# EAGLE design Randys_Gut (EAGLE 9.6.2)
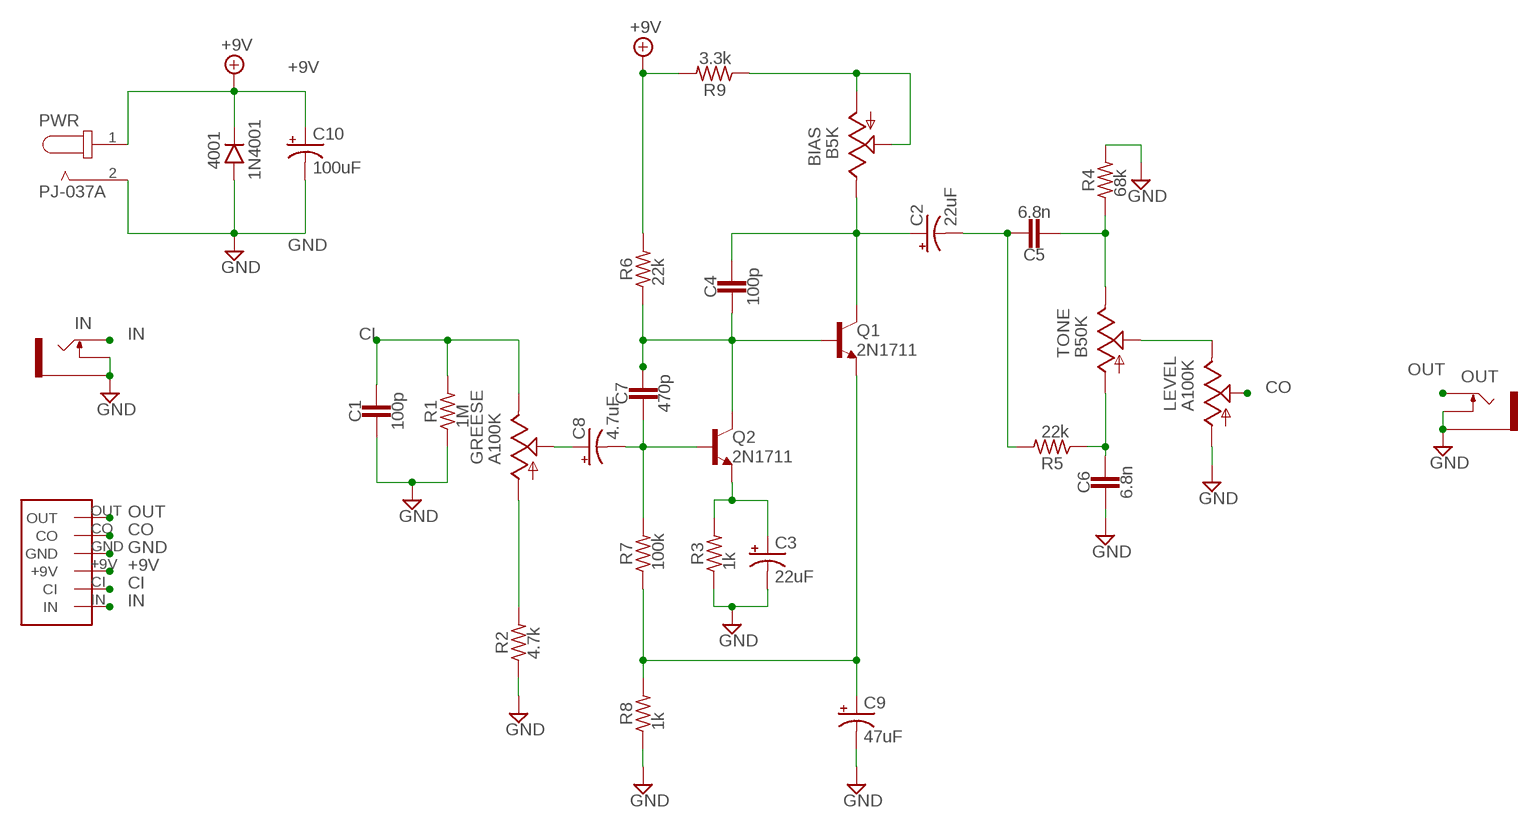
[diagram p0: schematic, sheet 1]

## Parts
4001  1N4001  DO41.3  [DO41-3]
BIAS  B5K  9MM_SNAP-IN_POT_  [9MM_SNAP-IN_POT]
C1  100p  CAP.2  [0.2".SML]
C2  22uF  0501  [050_020_1]
C3  22uF  0501  [050_020_1]
C4  100p  CAP.2  [0.2".SML]
C5  6.8n  CAP.2  [0.2".SML]
C6  6.8n  CAP.2  [0.2".SML]
C7  470p  CAP.2  [0.2".SML]
C8  4.7uF  0501  [050_020_1]
C9  47uF  0631  [063_025]
C10  100uF  0631  [063_025]
GREESE  A100K  9MM_SNAP-IN_POT_  [9MM_SNAP-IN_POT]
IN  THONKICONNNEW  [WQP-PJ301M-12_JACK]
LEVEL  A100K  9MM_SNAP-IN_POT_  [9MM_SNAP-IN_POT]
OUT  THONKICONNNEW  [WQP-PJ301M-12_JACK]
PWR  PJ-037A  [CUI_PJ-037A]
Q1  2N1711  2N2222A  [TO18]
Q2  2N1711  2N2222A  [TO18]
R1  1M  RESISTORS.3B  [R0207/3]
R2  4.7k  RESISTORS.3B  [R0207/3]
R3  1k  RESISTORS.3B  [R0207/3]
R4  68k  RESISTORS.3B  [R0207/3]
R5  22k  RESISTORS.3B  [R0207/3]
R6  22k  RESISTORS.3B  [R0207/3]
R7  100k  RESISTORS.3B  [R0207/3]
R8  1k  RESISTORS.3B  [R0207/3]
R9  3.3k  RESISTORS.3B  [R0207/3]
TONE  B50K  9MM_SNAP-IN_POT_  [9MM_SNAP-IN_POT]
U$2  HEADERS6  [HEADERS6]

## Nets
+9V: 4001.C C10.+ PWR.1 R6.2 R9.2 U$2.+9V
C3: C7.2 C8.- Q2.2(B) R7.2
CI: C1.1 GREESE.3(E) R1.2 U$2.CI
CO: LEVEL.2(S) U$2.CO
GND: 4001.A C1.2 C3.- C6.2 C9.- C10.- IN.P$2_SWITCH(SWITCH) IN.P$3_SLEEVE(SLEEVE) LEVEL.1(A) OUT.P$2_SWITCH(SWITCH) OUT.P$3_SLEEVE(SLEEVE) PWR.2 R1.1 R2.1 R3.1 R4.2 R8.1 U$2.GND
IN: IN.P$1_TIP(TIP) U$2.IN
N$1: GREESE.1(A) R2.2
N$3: C8.+ GREESE.2(S)
N$5: C9.+ Q1.1(E) R7.1 R8.2
N$6: C4.2 C7.1 Q1.2(B) Q2.3(C) R6.1
N$7: C3.+ Q2.1(E) R3.2
N$8: BIAS.3(E) C2.+ C4.1 Q1.3(C)
N$9: C2.- C5.1 R5.2
N$10: BIAS.1(A) BIAS.2(S) R9.1
N$11: C5.2 R4.1 TONE.3(E)
N$12: C6.1 R5.1 TONE.1(A)
N$13: LEVEL.3(E) TONE.2(S)
OUT: OUT.P$1_TIP(TIP) U$2.OUT

## Library data of the parts
4001 = diodes:DO41: DO-41 Package Diodes: 1N4001 - 1N40019 Zener Diodes: 1N4728 - 1N4764
BIAS GREESE LEVEL TONE = MusicThingModular:9MM_SNAP-IN_POT: 9mm vertical snap-in pot, Alpha / Panasonic style
C1 C4-C7 = caps-film:CAP: For Ceramic, Film, MLCC caps
C2 C3 C8 = caps-elec:050: 0.22 - 100uF Xicon values at Mouser.com: 10V: 10 - 100uF; 16V: 2.2 - 47uF; 25V: 0.47 - 47uF; 50V: 0.22 - 22uF
C9 C10 = caps-elec:063: 33 - 220uF Xicon values at Mouser.com 10V: 220uF; 16V: 100uF; 25V: 100uF; 50V: 33uF
IN OUT = MusicThingModular:THONKICONN: 3.5mm socket for Eurorack modular synths
PWR = Power Socket PJ-037A:PJ-037A: 2.0 mm Center Pin, 2.5 A, Right Angle, Through Hole, Dc Power Jack Connector; AVAILABILITY: Unavailable; CUI_PURCHASE_URL: https://www.cuidevices.com/product/interconnect/connectors/dc-power-connectors/jacks/pj-037a?utm_source=snapeda.com&utm_medium=referral&utm_campaign=snapedaBOM; DESCRIPTION: 2.0 x 6.5 mm, 2.5 A, Horizontal, Through Hole, Dc Power Jack Connector; MF: CUI Devices; MP: PJ-037A; PACKAGE: None; PRICE: None
Q1 Q2 = transistors-BJT:2N2222A: NPN [E]-B-C. TO-18 metal can transistor. 2n2369: http://smallbear-electronics.mybigcommerce.com/transistor-2n2369/
R1-R9 = resistors:RESISTORS
U$2 = my_headers:HEADERS6

## Board
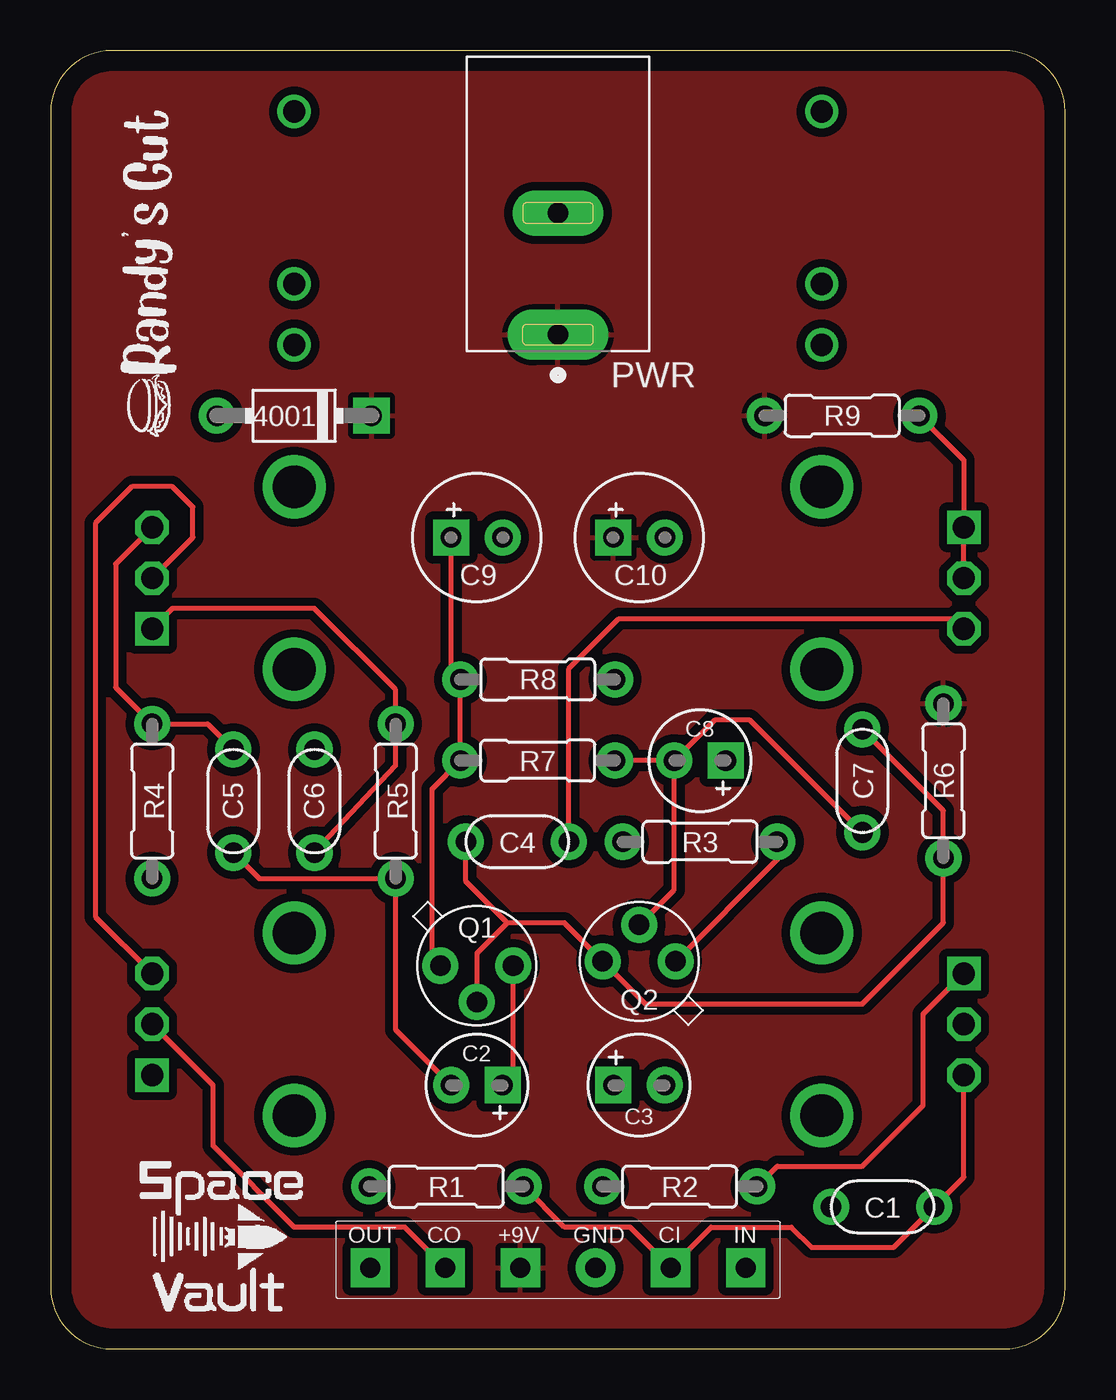
[diagram p1: board, top side]
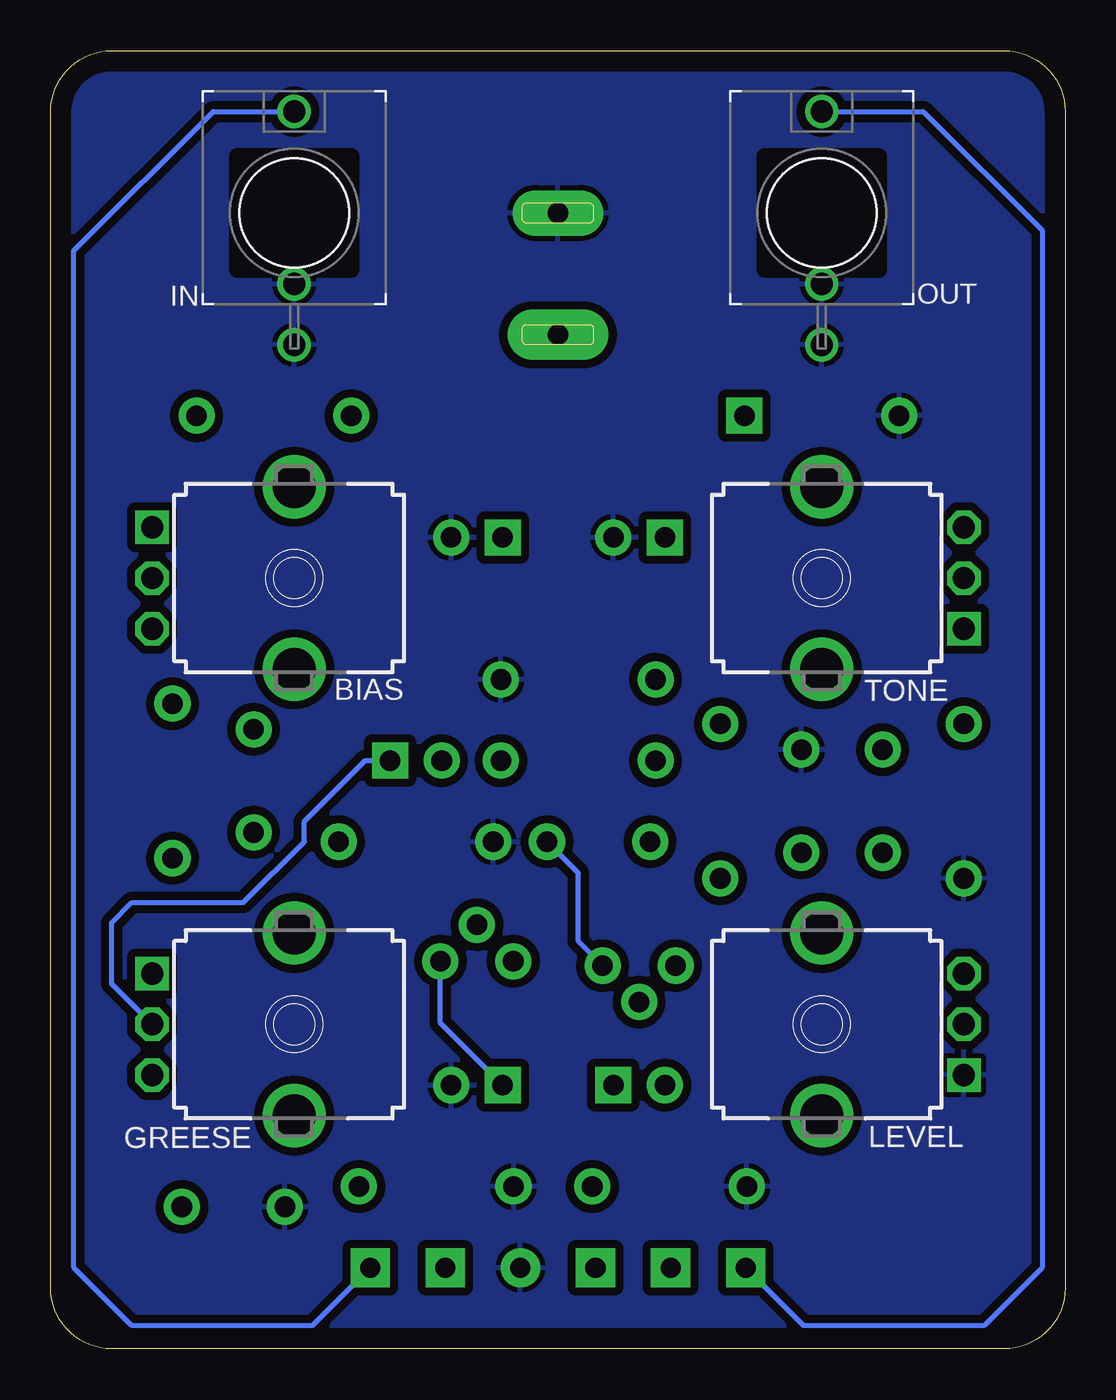
[diagram p2: board, bottom side, seen from below]

Size 50 x 64 mm. Coordinates in mm from the lower left corner, seen from the top.
Copper layers (1*16): Top 0.035mm / dielectric 1.5mm / Bottom 0.035mm
Design rules "default": minimum track width 6mil, minimum drill 0.35mm, track to track 6mil, track to pad 6mil, pad to pad 6mil, via to via 6mil, smd to smd 6mil, copper to edge 40mil, drill to drill 6mil, minimum pad ring 10mil, minimum via ring 8mil, stop-mask expansion 4mil, vias tented up to drill 0mil, thermal gap 10mil

### Footprints (pad centres in the part's own frame; a part is rotated, then mirrored left to right if it is on the bottom)
DO41-3 = drill 1.016 pad 1.778: A 3.81,0 | drill 1.016 pad 1.778 square: C -3.81,0
9MM_SNAP-IN_POT = drill 1.1 square: 1 -2.5,-7 | drill 1.1 octagon: 2 0,-7; 3 2.5,-7 | drill 2.1 pad 2.794: CHASSIS1 -4.5,0; CHASSIS2 4.5,0
0.2".SML = drill 1.016 pad 1.778: 1 -2.54,0; 2 2.54,0
050_020_1 = drill 1.016 pad 1.778 square: + -1.27,0 | drill 1.016 pad 1.778: - 1.27,0
063_025 = drill 1.016 pad 1.778 square: + -1.27,0 | drill 1.016 pad 1.778: - 1.27,0
WQP-PJ301M-12_JACK = drill 1.1: P$1_TIP 0,5; P$2_SWITCH 0,-3.5; P$3_SLEEVE 0,-6.5
CUI_PJ-037A = drill 1 pad 2.5 long: 1 0,0 | drill 1 pad 2.25 long: 2 6,0
TO18 = drill 1.016 pad 1.778: 1 -1.796,-0.109; 2 0,-1.905; 3 1.796,-0.109
R0207/3 = drill 1.016 pad 1.778: 1 -3.81,0; 2 3.81,0
HEADERS6 = drill 0.991 pad 1.93 square: +9V -1.85,0; CI 5.55,0; CO -5.55,0; IN 9.25,0; OUT -9.25,0 | drill 0.991 pad 1.93: GND 1.85,0

### Placement (x,y rotation side)
4001  12,46 180 top
BIAS  38,38 270 bottom
C1  41,7 180 top
C2  21,13 180 top
C3  29,13 0 top
C4  23,25 180 top
C5  9,27 90 top
C6  13,27 90 top
C7  40,28 270 top
C8  32,29 180 top
C9  21,40 0 top
C10  29,40 0 top
GREESE  38,16 270 bottom
IN  38,56 0 bottom
LEVEL  12,16 90 bottom
OUT  12,56 0 bottom
PWR  25,50 90 top
Q1  21,19 0 top
Q2  29,19 180 top
R1  19.5,8 0 top
R2  31,8 0 top
R3  32,25 0 top
R4  5,27 270 top
R5  17,27 270 top
R6  44,28 90 top
R7  24,29 0 top
R8  24,33 180 top
R9  39,46 180 top
TONE  12,38 90 bottom
U$1  [PANEL_12HP_NO_SWITCH]  0,0 0 top
U$2  25,4 0 top

### Tracks (layer width: path | path; a pad name or v marks a point on that pad's centre or on a via)
+9V
  pour Top (isolate 0.406): 0,3 0,61 arc-90 3,64 47,64 arc-90 50,61 50,3 arc-90 47,0 3,0 arc-90
C3
  Top 0.254: Q2.2 30.73,22.64 C8.- | C8.- R7.2 | C7.2 34.46,31 32.73,31 C8.-
CI
  Top 0.254: GREESE.3 45,8.46 C1.1 41.54,5 37.5,5 36.5,6 32.55,6 U$2.CI 28.55,6 25.31,6 R1.2
CO
  Top 0.254: LEVEL.2 8,13 8,10 12,6 17.45,6 U$2.CO
GND
  pour Bottom (isolate 0.406): 0,3 0,61 arc-90 3,64 47,64 arc-90 50,61 50,3 arc-90 47,0 3,0 arc-90
IN
  Bottom 0.254: U$2.IN 37.11,1.14 46,1.14 48.86,4 48.86,54.14 42,61 IN.P$1_TIP
N$1
  Top 0.254: R2.2 35.81,9 40,9 43,12 43,16.5 GREESE.1
N$3
  Bottom 0.254: GREESE.2 47,18 47,21 46,22 40.5,22 37.5,25 37.5,26 34.5,29 C8.+
N$5
  Top 0.254: Q1.1 18.8,19.3 18.8,27.61 R7.1 R8.2 19.73,33.46 C9.+
N$6
  Top 0.254: C7.1 44,26.54 R6.1 44,21 40,17 29.31,17 Q2.3 25.31,21 22.5,21 | 22.5,21 21,19.5 Q1.2 | 22.5,21 20.46,23.04 C4.2
N$7
  Top 0.254: Q2.1 35.81,24.12 R3.2
  Bottom 0.254: C3.+ 30.8,16.07 Q2.1
N$8
  Top 0.254: C2.+ 22.8,13.53 Q1.3 | C4.1 25.54,33.54 28,36 44.5,36 BIAS.3
  Bottom 0.254: Q1.3 24,20.09 24,23.46 C4.1
N$9
  Top 0.254: C2.- 17,15.73 R5.2 10.27,23.19 C5.1
N$10
  Top 0.254: R9.1 45,43.81 BIAS.1 BIAS.2
N$11
  Top 0.254: C5.2 7.73,30.81 R4.1 3.2,32.61 3.2,38.7 TONE.3
N$12
  Top 0.254: C6.1 17,28.75 R5.1 17,32.5 13,36.5 6,36.5 TONE.1
N$13
  Top 0.254: TONE.2 7,40 7,41.5 6,42.5 4,42.5 2.2,40.7 2.2,21.3 LEVEL.3
OUT
  Bottom 0.254: OUT.P$1_TIP 7,61 1.14,55.14 1.14,4 4,1.14 12.89,1.14 U$2.OUT